# Altium project PCB_Project.PrjPcb
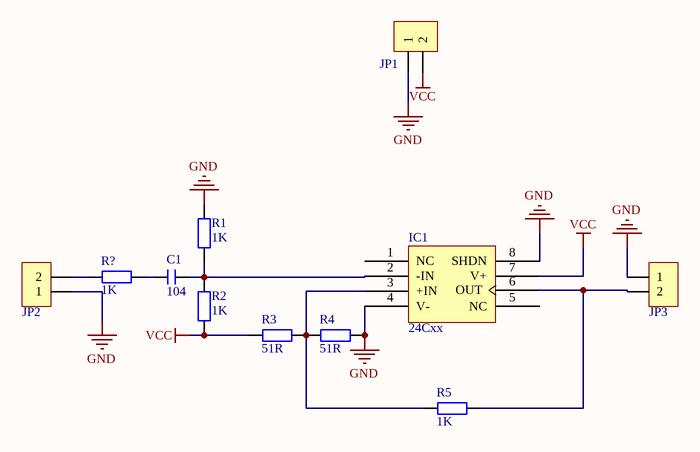
[diagram p0: Sheet1.SchDoc]
1 sheet, 11 parts. Net scope: global (net labels, ports and power ports of the same name join across sheets).
Board files: PCB1.PcbDoc, PCB2.PcbDoc

## Sheet Sheet1.SchDoc
size A4

### Parts
C1  104  [C 0805_M]
IC1  24Cxx  [SOP8_M]
JP1  HDR-1X2  [HDR2.54-LI-2P]  (value not drawn)
JP2  HDR-1X2  [HDR2.54-LI-2P]  (value not drawn)
JP3  HDR-1X2  [HDR2.54-LI-2P]  (value not drawn)
R1  1K  [R 0805_M]
R2  1K  [R 0805_M]
R3  51R  [R 0805_M]
R4  51R  [R 0805_M]
R5  1K  [R 0805_M]
R?  1K  [R 0805_M]

### Nets
GND: IC1.4(V-) IC1.8(SHDN) JP1.1 JP2.1 JP3.1 R1.2 R4.1
VCC: IC1.7(V+) JP1.2 R2.1 R3.2
NetC1_1: C1.1 R?.1
NetC1_2: C1.2 IC1.2(-IN) R1.1 R2.2
NetIC1_3: IC1.3(+IN) R3.1 R4.2 R5.2
NetIC1_6: IC1.6(OUT) JP3.2 R5.1
NetJP2_2: JP2.2 R?.2

Not connected (* = marked no-connect by the designer): IC1 1(NC) 5(NC)

### Library data of the parts
C1 = C: 无极性贴片电容; 版权归属: 源创客; BOM名称: 无极性贴片电容; 学习资源: www.ooocke.com
IC1 = 24Cxx: 外置EEPROM; 版权归属: 源创客; BOM名称: 外置EEPROM; 学习资源: www.ooocke.com
JP1-JP3 = Header 2: 2P接插件; 版权归属: 源创客; BOM名称: 2P接插件; 学习资源: www.ooocke.com
R1-R5 R? = R: 贴片电阻; 版权归属: 源创客; BOM名称: 贴片电阻; 学习资源: www.ooocke.com